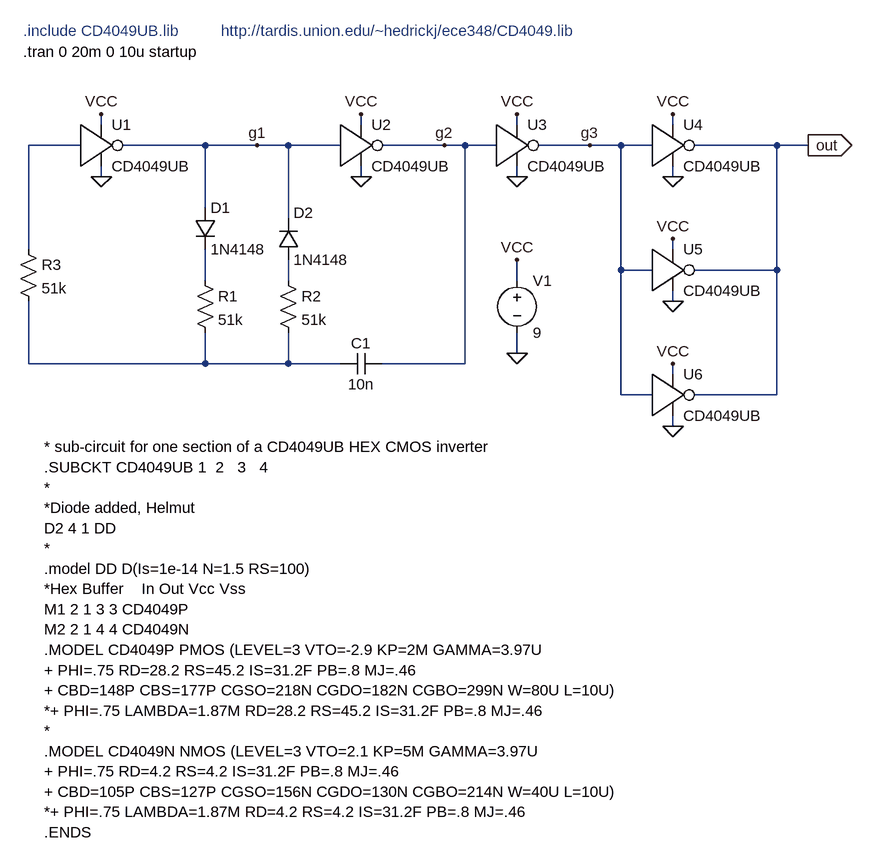
[diagram p0: schematic CD4049UB_rc_osc1.asc]
CD4049UB_rc_osc1.asc, the LTspice schematic file:
Version 4
SHEET 1 1164 1256
WIRE -496 128 -496 112
WIRE -96 128 -96 112
WIRE 144 128 144 112
WIRE 384 128 384 112
WIRE -528 160 -608 160
WIRE -336 160 -464 160
WIRE -256 160 -336 160
WIRE -208 160 -256 160
WIRE -128 160 -208 160
WIRE 32 160 -64 160
WIRE 64 160 32 160
WIRE 112 160 64 160
WIRE 256 160 176 160
WIRE 304 160 256 160
WIRE 352 160 304 160
WIRE 544 160 416 160
WIRE 592 160 544 160
WIRE -496 208 -496 192
WIRE -96 208 -96 192
WIRE 144 208 144 192
WIRE 384 208 384 192
WIRE -336 256 -336 160
WIRE -208 272 -208 160
WIRE -608 320 -608 160
WIRE 384 320 384 304
WIRE 304 352 304 160
WIRE 352 352 304 352
WIRE 544 352 544 160
WIRE 544 352 416 352
WIRE -336 368 -336 320
WIRE -208 368 -208 336
WIRE 144 368 144 336
WIRE 384 400 384 384
WIRE 144 480 144 448
WIRE -608 496 -608 400
WIRE -336 496 -336 448
WIRE -336 496 -608 496
WIRE -208 496 -208 448
WIRE -208 496 -336 496
WIRE -128 496 -208 496
WIRE 64 496 64 160
WIRE 64 496 -64 496
WIRE 384 512 384 496
WIRE 304 544 304 352
WIRE 352 544 304 544
WIRE 544 544 544 352
WIRE 544 544 416 544
WIRE 384 592 384 576
FLAG 144 208 0
FLAG 384 208 0
FLAG -96 208 0
FLAG -496 208 0
FLAG -496 112 VCC
FLAG -96 112 VCC
FLAG 144 112 VCC
FLAG 384 112 VCC
FLAG 144 336 VCC
FLAG 144 480 0
FLAG 384 400 0
FLAG 384 304 VCC
FLAG 384 592 0
FLAG 384 496 VCC
FLAG -256 160 g1
FLAG 32 160 g2
FLAG 256 160 g3
FLAG 592 160 out
IOPIN 592 160 Out
SYMBOL buffer_inv1 -512 160 R0
SYMATTR InstName U1
SYMATTR Value CD4049UB
SYMBOL diode -352 256 R0
SYMATTR InstName D1
SYMATTR Value 1N4148
SYMBOL diode -224 336 M180
WINDOW 0 24 72 Left 0
WINDOW 3 24 0 Left 0
SYMATTR InstName D2
SYMATTR Value 1N4148
SYMBOL res -352 352 R0
SYMATTR InstName R1
SYMATTR Value 51k
SYMBOL res -224 352 R0
SYMATTR InstName R2
SYMATTR Value 51k
SYMBOL res -624 304 R0
SYMATTR InstName R3
SYMATTR Value 51k
SYMBOL buffer_inv1 -112 160 R0
SYMATTR InstName U2
SYMATTR Value CD4049UB
SYMBOL cap -128 512 R270
WINDOW 0 32 32 VTop 0
WINDOW 3 0 32 VBottom 0
SYMATTR InstName C1
SYMATTR Value 10n
SYMBOL buffer_inv1 128 160 R0
SYMATTR InstName U3
SYMATTR Value CD4049UB
SYMBOL buffer_inv1 368 160 R0
SYMATTR InstName U4
SYMATTR Value CD4049UB
SYMBOL voltage 144 352 R0
SYMATTR InstName V1
SYMATTR Value 9
SYMBOL buffer_inv1 368 352 R0
SYMATTR InstName U5
SYMATTR Value CD4049UB
SYMBOL buffer_inv1 368 544 R0
SYMATTR InstName U6
SYMATTR Value CD4049UB
TEXT -584 624 Left 0 !* sub-circuit for one section of a CD4049UB HEX CMOS inverter\n.SUBCKT CD4049UB 1  2   3   4\n*\n*Diode added, Helmut\nD2 4 1 DD\n*\n.model DD D(Is=1e-14 N=1.5 RS=100)\n*Hex Buffer    In Out Vcc Vss\nM1 2 1 3 3 CD4049P\nM2 2 1 4 4 CD4049N\n.MODEL CD4049P PMOS (LEVEL=3 VTO=-2.9 KP=2M GAMMA=3.97U\n+ PHI=.75 RD=28.2 RS=45.2 IS=31.2F PB=.8 MJ=.46\n+ CBD=148P CBS=177P CGSO=218N CGDO=182N CGBO=299N W=80U L=10U)\n*+ PHI=.75 LAMBDA=1.87M RD=28.2 RS=45.2 IS=31.2F PB=.8 MJ=.46\n*\n.MODEL CD4049N NMOS (LEVEL=3 VTO=2.1 KP=5M GAMMA=3.97U\n+ PHI=.75 RD=4.2 RS=4.2 IS=31.2F PB=.8 MJ=.46\n+ CBD=105P CBS=127P CGSO=156N CGDO=130N CGBO=214N W=40U L=10U)\n*+ PHI=.75 LAMBDA=1.87M RD=4.2 RS=4.2 IS=31.2F PB=.8 MJ=.46\n.ENDS
TEXT -312 -16 Left 0 ;http://tardis.union.edu/~hedrickj/ece348/CD4049.lib
TEXT -616 16 Left 0 !.tran 0 20m 0 10u startup
TEXT -616 -16 Left 0 ;.include CD4049UB.lib

The netlist it stands for:
* CD4049UB_rc_osc1.asc
XU1 N001 g1 VCC 0 CD4049UB  ; pins IN OUT V+ V-
D1 g1 N002 1N4148
D2 N003 g1 1N4148
R1 N002 N004 51k
R2 N003 N004 51k
R3 N001 N004 51k
XU2 g1 g2 VCC 0 CD4049UB  ; pins IN OUT V+ V-
C1 N004 g2 10n
XU3 g2 g3 VCC 0 CD4049UB  ; pins IN OUT V+ V-
XU4 g3 out VCC 0 CD4049UB  ; pins IN OUT V+ V-
V1 VCC 0 9
XU5 g3 out VCC 0 CD4049UB  ; pins IN OUT V+ V-
XU6 g3 out VCC 0 CD4049UB  ; pins IN OUT V+ V-
.model D D
.lib standard.dio
* sub-circuit for one section of a CD4049UB HEX CMOS inverter
.SUBCKT CD4049UB 1  2   3   4
*
*Diode added, Helmut
D2 4 1 DD
*
.model DD D(Is=1e-14 N=1.5 RS=100)
*Hex Buffer    In Out Vcc Vss
M1 2 1 3 3 CD4049P
M2 2 1 4 4 CD4049N
.MODEL CD4049P PMOS (LEVEL=3 VTO=-2.9 KP=2M GAMMA=3.97U
+ PHI=.75 RD=28.2 RS=45.2 IS=31.2F PB=.8 MJ=.46
+ CBD=148P CBS=177P CGSO=218N CGDO=182N CGBO=299N W=80U L=10U)
*+ PHI=.75 LAMBDA=1.87M RD=28.2 RS=45.2 IS=31.2F PB=.8 MJ=.46
*
.MODEL CD4049N NMOS (LEVEL=3 VTO=2.1 KP=5M GAMMA=3.97U
+ PHI=.75 RD=4.2 RS=4.2 IS=31.2F PB=.8 MJ=.46
+ CBD=105P CBS=127P CGSO=156N CGDO=130N CGBO=214N W=40U L=10U)
*+ PHI=.75 LAMBDA=1.87M RD=4.2 RS=4.2 IS=31.2F PB=.8 MJ=.46
.ENDS
* http://tardis.union.edu/~hedrickj/ece348/CD4049.lib
.tran 0 20m 0 10u startup
* .include CD4049UB.lib
.backanno
.end